# Altium schematic sheet PMOD_ARD_RASP.SchDoc
size A3
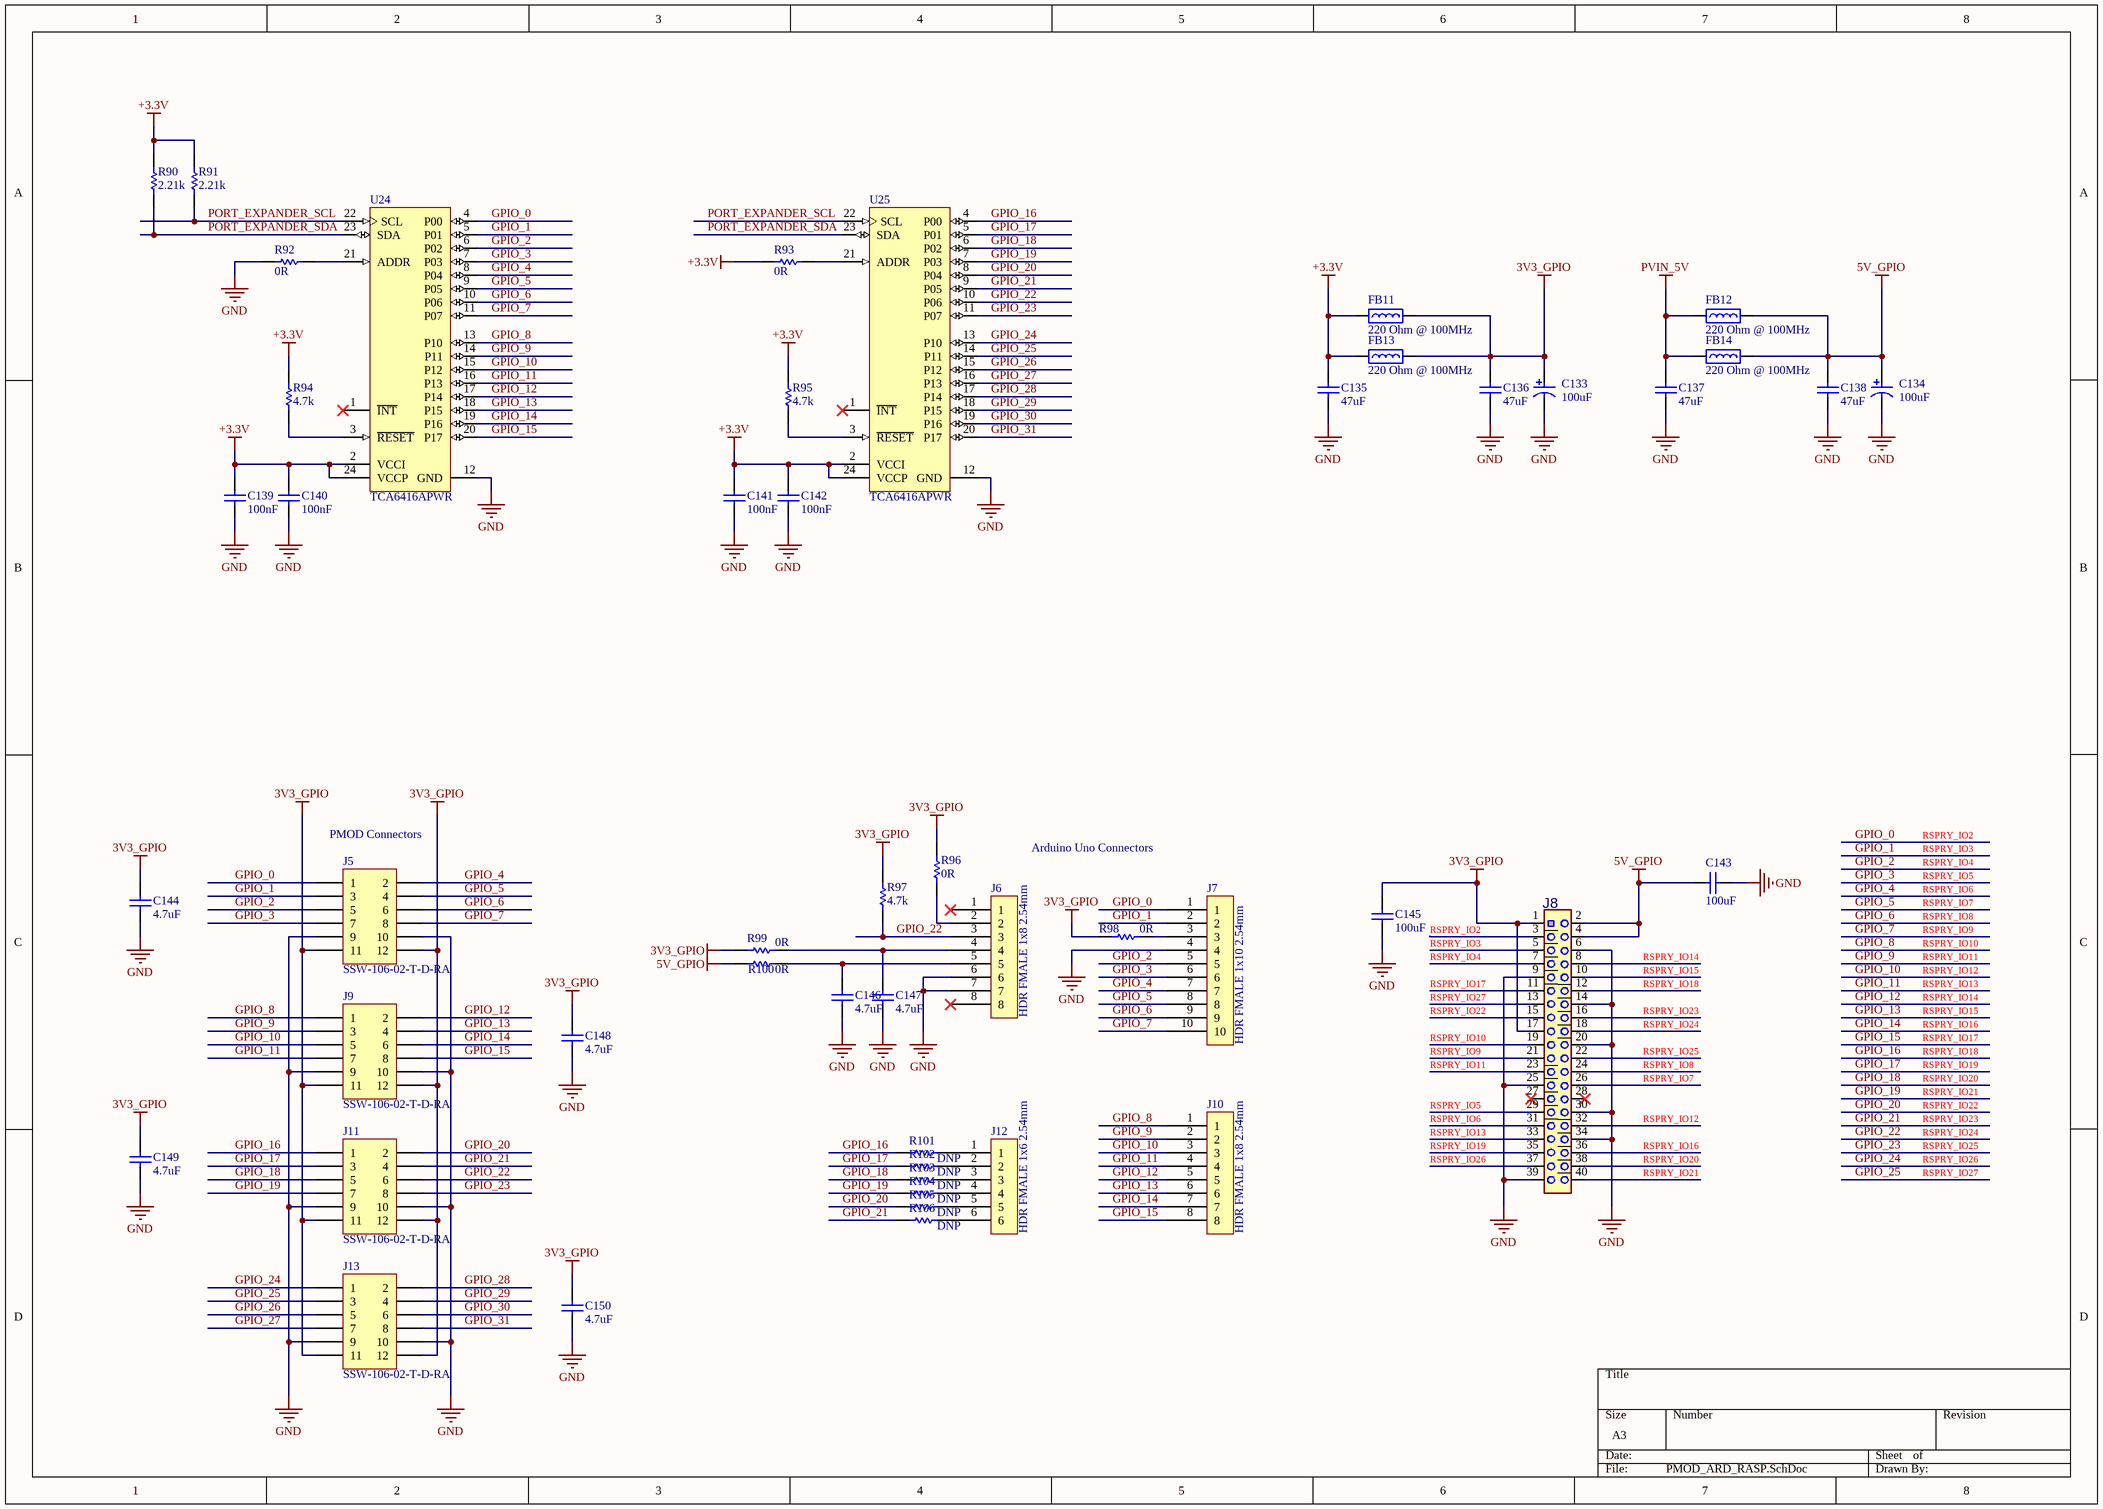
[diagram p0: PMOD_ARD_RASP.SchDoc]

## Parts
C133  100uF  [AVX_TAN_F95_P_0905]
C134  100uF  [AVX_TAN_F95_P_0905]
C135  47uF  [CAPC3216L_1206]
C136  47uF  [CAPC3216L_1206]
C137  47uF  [CAPC3216L_1206]
C138  47uF  [CAPC3216L_1206]
C139  100nF  [CAPC1005L_0402]
C140  100nF  [CAPC1005L_0402]
C141  100nF  [CAPC1005L_0402]
C142  100nF  [CAPC1005L_0402]
C143  100uF  [CAPC3225N_1210]
C144  4.7uF  [CAPC1005L_0402]
C145  100uF  [CAPC3225N_1210]
C146  4.7uF  [CAPC1005L_0402]
C147  4.7uF  [CAPC1005L_0402]
C148  4.7uF  [CAPC1005L_0402]
C149  4.7uF  [CAPC1005L_0402]
C150  4.7uF  [CAPC1005L_0402]
FB11  Impedance @ Frequency: 220 Ohm @ 100MHz  [INDC1608N_0603]  (hidden comment: BEAD0603_220_2A5_40M)
FB12  Impedance @ Frequency: 220 Ohm @ 100MHz  [INDC1608N_0603]  (hidden comment: BEAD0603_220_2A5_40M)
FB13  Impedance @ Frequency: 220 Ohm @ 100MHz  [INDC1608N_0603]  (hidden comment: BEAD0603_220_2A5_40M)
FB14  Impedance @ Frequency: 220 Ohm @ 100MHz  [INDC1608N_0603]  (hidden comment: BEAD0603_220_2A5_40M)
J5  SSW-106-02-T-D-RA  [HDR2X6H]
J6  HDR FMALE 1x8 2.54mm  [Hdr_Female_1x8_2.54mm]
J7  HDR FMALE 1x10 2.54mm  [Hdr_Female_1x10_2.54mm]
J8  Header 2x20  [HDR_M_2.54_2x20]  (value not drawn)
J9  SSW-106-02-T-D-RA  [HDR2X6H]
J10  HDR FMALE 1x8 2.54mm  [Hdr_Female_1x8_2.54mm]
J11  SSW-106-02-T-D-RA  [HDR2X6H]
J12  HDR FMALE 1x6 2.54mm  [Hdr_Female_1x6_2.54mm]
J13  SSW-106-02-T-D-RA  [HDR2X6H]
R90  value 2.21k  [RESC1005L_0402]  (hidden comment: RES0402_2K21_0W1_1T)
R91  value 2.21k  [RESC1005L_0402]  (hidden comment: RES0402_2K21_0W1_1T)
R92  value 0R  [RESC1005L_0402]  (hidden comment: RES0402_0R_0W1)
R93  value 0R  [RESC1005L_0402]  (hidden comment: RES0402_0R_0W1)
R94  value 4.7k  [RESC1005L_0402]  (hidden comment: RES0402_4K7_0W1_1T)
R95  value 4.7k  [RESC1005L_0402]  (hidden comment: RES0402_4K7_0W1_1T)
R96  value 0R  [RESC1005L_0402]  (hidden comment: RES0402_0R)
R97  value 4.7k  [RESC1005L_0402]  (hidden comment: RES0402_4K7_0W1_1T)
R98  value 0R  [RESC1005L_0402]  (hidden comment: RES0402_0R)
R99  value 0R  [RESC1005L_0402]  (hidden comment: RES0402_0R)
R100  value 0R  [RESC1005L_0402]  (hidden comment: RES0402_0R)
R101  value DNP  [RESC1005L_0402]  (hidden comment: RES0402)
R102  value DNP  [RESC1005L_0402]  (hidden comment: RES0402)
R103  value DNP  [RESC1005L_0402]  (hidden comment: RES0402)
R104  value DNP  [RESC1005L_0402]  (hidden comment: RES0402)
R105  value DNP  [RESC1005L_0402]  (hidden comment: RES0402)
R106  value DNP  [RESC1005L_0402]  (hidden comment: RES0402)
U24  TCA6416APWR  [PW24_L]
U25  TCA6416APWR  [PW24_L]

## Nets
3V3_GPIO: C133.1 C136.2 C144.2 C145.2 C148.2 C149.2 C150.2 FB11.2 FB13.2 J5.11 J5.12 J8.1(P1) J8.17(P17) J9.11 J9.12 J11.11 J11.12 J13.11 J13.12 R96.1 R97.2 R98.2 R99.2
5V_GPIO: C134.1 C138.2 C143.2 FB12.2 FB14.2 J8.2(P2) J8.4(P4) R100.2
+3.3V: C135.2 C139.2 C140.2 C141.2 C142.2 FB11.1 FB13.1 R90.2 R91.2 R93.1 R94.2 R95.2 U24.2(VCCI) U24.24(VCCP) U25.2(VCCI) U25.24(VCCP)
GND: C133.2 C134.2 C135.1 C136.1 C137.1 C138.1 C139.1 C140.1 C141.1 C142.1 C143.1 C144.1 C145.1 C146.1 C147.1 C148.1 C149.1 C150.1 J5.9 J5.10 J6.6 J6.7 J7.4 J8.6(P6) J8.9(P9) J8.14(P14) J8.20(P20) J8.25(P25) J8.30(P30) J8.34(P34) J8.39(P39) J9.9 J9.10 J11.9 J11.10 J13.9 J13.10 R92.1 U24.12(GND) U25.12(GND)
PVIN_5V: C137.2 FB12.1 FB14.1
GPIO_0: J5.1 J7.1 J8.3(P3) U24.4(P00)  [also labelled RSPRY_IO2]
GPIO_1: J5.3 J7.2 J8.5(P5) U24.5(P01)  [also labelled RSPRY_IO3]
GPIO_2: J5.5 J7.5 J8.7(P7) U24.6(P02)  [also labelled RSPRY_IO4]
GPIO_3: J5.7 J7.6 J8.29(P29) U24.7(P03)  [also labelled RSPRY_IO5]
GPIO_4: J5.2 J7.7 J8.31(P31) U24.8(P04)  [also labelled RSPRY_IO6]
GPIO_5: J5.4 J7.8 J8.26(P26) U24.9(P05)  [also labelled RSPRY_IO7]
GPIO_6: J5.6 J7.9 J8.24(P24) U24.10(P06)  [also labelled RSPRY_IO8]
GPIO_7: J5.8 J7.10 J8.21(P21) U24.11(P07)  [also labelled RSPRY_IO9]
GPIO_8: J8.19(P19) J9.1 J10.1 U24.13(P10)  [also labelled RSPRY_IO10]
GPIO_9: J8.23(P23) J9.3 J10.2 U24.14(P11)  [also labelled RSPRY_IO11]
GPIO_10: J8.32(P32) J9.5 J10.3 U24.15(P12)  [also labelled RSPRY_IO12]
GPIO_11: J8.33(P33) J9.7 J10.4 U24.16(P13)  [also labelled RSPRY_IO13]
GPIO_12: J8.8(P8) J9.2 J10.5 U24.17(P14)  [also labelled RSPRY_IO14]
GPIO_13: J8.10(P10) J9.4 J10.6 U24.18(P15)  [also labelled RSPRY_IO15]
GPIO_14: J8.36(P36) J9.6 J10.7 U24.19(P16)  [also labelled RSPRY_IO16]
GPIO_15: J8.11(P11) J9.8 J10.8 U24.20(P17)  [also labelled RSPRY_IO17]
GPIO_16: J8.12(P12) J11.1 R101.1 U25.4(P00)  [also labelled RSPRY_IO18]
GPIO_17: J8.35(P35) J11.3 R102.1 U25.5(P01)  [also labelled RSPRY_IO19]
GPIO_18: J8.38(P38) J11.5 R103.1 U25.6(P02)  [also labelled RSPRY_IO20]
GPIO_19: J8.40(P40) J11.7 R104.1 U25.7(P03)  [also labelled RSPRY_IO21]
GPIO_20: J8.15(P15) J11.2 R105.1 U25.8(P04)  [also labelled RSPRY_IO22]
GPIO_21: J8.16(P16) J11.4 R106.1 U25.9(P05)  [also labelled RSPRY_IO23]
GPIO_22: J6.3 J8.18(P18) J11.6 R97.1 U25.10(P06)  [also labelled RSPRY_IO24]
GPIO_23: J8.22(P22) J11.8 U25.11(P07)  [also labelled RSPRY_IO25]
GPIO_24: J8.37(P37) J13.1 U25.13(P10)  [also labelled RSPRY_IO26]
GPIO_25: J8.13(P13) J13.3 U25.14(P11)  [also labelled RSPRY_IO27]
GPIO_26: J13.5 U25.15(P12)
GPIO_27: J13.7 U25.16(P13)
GPIO_28: J13.2 U25.17(P14)
GPIO_29: J13.4 U25.18(P15)
GPIO_30: J13.6 U25.19(P16)
GPIO_31: J13.8 U25.20(P17)
PORT_EXPANDER_SCL: R91.1 U24.22(SCL) U25.22(SCL)
PORT_EXPANDER_SDA: R90.1 U24.23(SDA) U25.23(SDA)
NetC146_2: C146.2 J6.5 R100.1
NetC147_2: C147.2 J6.4 R99.1
NetJ6_2: J6.2 R96.2
NetJ7_3: J7.3 R98.1
NetJ12_1: J12.1 R101.2
NetJ12_2: J12.2 R102.2
NetJ12_3: J12.3 R103.2
NetJ12_4: J12.4 R104.2
NetJ12_5: J12.5 R105.2
NetJ12_6: J12.6 R106.2
NetR92_2: R92.2 U24.21(ADDR)
NetR93_2: R93.2 U25.21(ADDR)
NetR94_1: R94.1 U24.3(~{RESET})
NetR95_1: R95.1 U25.3(~{RESET})

Not connected (* = marked no-connect by the designer): J6 1* 8*; J8 27(P27)* 28(P28)*; U24 1(~{INT})*; U25 1(~{INT})*

## Notes on the sheet
- (near J5) PMOD Connectors
- Arduino Uno Connectors

## Library data of the parts
C133 C134 = CAPELE0905TAN100U6V3_20T: CAP TANT 100UF 6.3V 20% 0805; Manufacturer 1: AVX Corporation; Manufacturer Part Number 1: F950J107MPAAQ2; Temperature Coefficient: Tantalum; ESR: 1.2 Ohm; Package: 0905 P; ComponentLink1Description: Datasheet; ComponentLink1URL: C:\Users\Public\Documents\Altium\AD16\Library\PDF\F95.pdf; Value: 100uF; Voltage: 6.3V; Tolerance: 20%; Supplier 1: Digi-Key; Supplier Part Number 1: 478-8393-1-ND; Operating Temperature: -55°C ~ 125°C
C135-C138 = CAPCER1206X5R47U25V_20T: CAP CER 47UF 25V X5R 1206; Manufacturer 1: TDK Corporation; Manufacturer Part Number 1: C3216X5R1E476M160AC; Tolerance: 20%; Package: 1206; ComponentLink1Description: Datasheet; Value: 47uF; Voltage: 25V; Temperature Coefficient: X5R; Supplier 1: Digi-Key; Supplier Part Number 1: 445-8047-1-ND; Operating Temperature: -55°C ~ 85°C
C139-C142 = CAPCER0402X7R100N25V_10T: CAP CER 0.1UF 25V X7R 0402; Manufacturer 1: Murata Electronics North America; Manufacturer Part Number 1: GRM155R71E104KE14D; Tolerance: 10%; Package: 0402; ComponentLink1Description: Datasheet; Value: 100nF; Voltage: 25V; Temperature Coefficient: X7R; Supplier 1: Digi-Key; Supplier Part Number 1: 490-10698-1-ND; Operating Temperature: -55°C ~ 125°C
C143 C145 = CAPCER1210X5R100U16V_20T: CAP CER 100UF 16V X5R 1210; Manufacturer 1: Taiyo Yuden; Manufacturer Part Number 1: EMK325ABJ107MM-T; Tolerance: 20%; Package: 1210; ComponentLink1Description: Datasheet; Value: 100uF; Voltage: 16V; Temperature Coefficient: X5R; Supplier 1: Digi-Key; Supplier Part Number 1: 587-3152-1-ND; Operating Temperature: -55°C ~ 85°C
C144 C146-C150 = CAPCER0402X5R4U710V_10T: CAP CER 4.7UF 10V X5R 0402; Manufacturer 1: TDK Corporation; Manufacturer Part Number 1: C1005X5R1A475K050BC; Tolerance: 10%; Package: 0402; ComponentLink1Description: Datasheet; Value: 4.7uF; Voltage: 10V; Temperature Coefficient: x5R; Supplier 1: Digi-Key; Supplier Part Number 1: 445-13820-1-ND; Operating Temperature: -55°C ~ 85°C
FB11-FB14 = BEAD0603_220_2A5_40M: FERRITE BEAD 220 OHM 0603 1LN; Manufacturer 1: Murata Electronics North America; Manufacturer Part Number 1: BLM18SG221TN1D; Current Rating (Max): 2.5A; DC Resistance (DCR) (Max): 40 mohm; Package: 0603; ComponentLink1Description: Datasheet; ComponentLink1URL: C:\Users\Public\Documents\Altium\AD16\Library\PDF\ENFA0003.pdf; Supplier 1: Digi-Key; Supplier Part Number 1: 490-5225-1-ND; Operating Temperature: -55°C ~ 125°C
J5 J9 J11 J13 = SSW-106-02-T-D-RA: CONN RCPT .100" 12PS DL R/A TIN; Manufacturer 1: Samtec Inc.; ComponentLink1Description: Datasheet; ComponentLink1URL: C:\Users\Public\Documents\Altium\AD16\Library\PDF\ssw-1xx-xx-xxx-x-xx-xxx-xx-mkt.pdf; Supplier 1: Digi-Key; Supplier Part Number 1: SAM10026-ND; Manufacturer Part Number 1: SSW-106-02-T-D-RA; Operating Temperature: -55°C ~ 105°C; Insulation Height: 0.195" (4.95mm)
J6 J10 = M20-7820842: 08-WAY SIL VERT SOCKET L/FREE; Manufacturer 1: Harwin Inc; Connector Type: Receptacle; Number of Positions: 8; Number of Positions Loaded: All; Pitch: 0.100" (2.54mm); .Creator: MM; .Checked PCB: RF; Supplier 1: Digi-Key; Manufacturer Part Number 1: M20-7820842; RoHS: RoHS Compliant; Category: Connectors, Interconnects; Stock 1: 2070; Pricing 1: 1=1.1, 29=0.91207, 58=0.87397, 116=0.83603, 261=0.76, 522=0.684, 1015=0.608, 2523=0.551 (USD); Packaging: Tube; Contact Type: Female Socket; Number of Rows: 1; Row Spacing: -; Mounting Type: Through Hole; Termination: Solder; Fastening Type: -; Features: -; Contact Finish: Gold; Contact Finish Thickness: Flash; Color: Black; ComponentLink1URL: http://harwin.com/includes/pdfs/M20-782.pdf; ComponentLink1Description: http://harwin.com/includes/pdfs/M20-782.pdf; Supplier Part Number 1: 952-1823-ND; .Checked SCH: RF
J7 = M20-7821046: 10-WAY SIL VERT SOCKET L/FREE; Manufacturer 1: Harwin Inc; Connector Type: Receptacle; Number of Positions: 10; Number of Positions Loaded: All; Pitch: 0.100" (2.54mm); .Creator: MM; .Checked PCB: RF; Supplier 1: Digi-Key; Manufacturer Part Number 1: M20-7821046; RoHS: RoHS Compliant; Category: Connectors, Interconnects; Stock 1: 214; Pricing 1: 1=1.28, 23=1.12217, 46=1.05609, 69=1.01203, 115=0.968, 253=0.88, 506=0.792, 1012=0.704, 2507=0.638 (USD); Packaging: Tube; Contact Type: Female Socket; Number of Rows: 1; Row Spacing: -; Mounting Type: Through Hole; Termination: Solder; Fastening Type: -; Features: -; Contact Finish: Tin; Contact Finish Thickness: -; Color: Black; ComponentLink1URL: http://harwin.com/includes/pdfs/M20-782.pdf; ComponentLink1Description: http://harwin.com/includes/pdfs/M20-782.pdf; Supplier Part Number 1: 952-1847-ND; .Checked SCH: RF
J8 = Header 2x20: CONN HEADER 40POS .100" SGL GOLD
J12 = M20-7820646: 06-WAY SIL VERT SOCKET L/FREE; Manufacturer 1: Harwin Inc; Connector Type: Receptacle; Number of Positions: 6; Number of Positions Loaded: All; Pitch: 0.100" (2.54mm); .Checked PCB: MM; Supplier 1: Digi-Key; Manufacturer Part Number 1: M20-7820646; RoHS: RoHS Compliant; Category: Connectors, Interconnects; Stock 1: 87; Pricing 1: 1=0.96, 38=0.79211, 76=0.75895, 114=0.72596, 266=0.66, 532=0.594, 1026=0.528, 2508=0.4785 (USD); Packaging: Tube; Contact Type: Female Socket; Number of Rows: 1; Row Spacing: -; Mounting Type: Through Hole; Termination: Solder; Fastening Type: -; Features: -; Contact Finish: Tin; Contact Finish Thickness: -; Color: Black; ComponentLink1URL: http://harwin.com/includes/pdfs/M20-782.pdf; ComponentLink1Description: http://harwin.com/includes/pdfs/M20-782.pdf; Supplier Part Number 1: 952-1809-ND; .Checked SCH: MM; .Creator: MM
R90 R91 = RES0402_2K21_0W1_1T: RES SMD 2.21K OHM 1% 1/10W 0402; Manufacturer 1: Panasonic Electronic Components; Manufacturer Part Number 1: ERJ-2RKF2211X; Package: 0402; ComponentLink1Description: Datasheet; Power: 1/10W; Tolerance: 1%; Supplier 1: Digi-Key; Supplier Part Number 1: P2.21KLCT-ND
R92 R93 = RES0402_0R_0W1: RES SMD 0 OHM JUMPER 1/10W 0402; Manufacturer 1: Panasonic Electronic Components; Manufacturer Part Number 1: ERJ-2GE0R00X; Package: 0402; ComponentLink1Description: Datasheet; Power: 1/10W; Tolerance: -; Supplier 1: Digi-Key; Supplier Part Number 1: P0.0JCT-ND
R94 R95 R97 = RES0402_4K7_0W1_1T: RES SMD 4.7K OHM 1% 1/10W 0402; Manufacturer 1: Panasonic Electronic Components; Manufacturer Part Number 1: ERJ-2RKF4701X; Package: 0402; ComponentLink1Description: Datasheet; Power: 1/10W; Tolerance: 1%; Supplier 1: Digi-Key; Supplier Part Number 1: P4.70KLCT-ND
R96 R98-R100 = RES0402_0R: RES SMD 0 OHM JUMPER 1/16W 0402; Manufacturer 1: Vishay Dale; Manufacturer Part Number 1: CRCW04020000Z0ED; Power: 0.063W, 1/16W; Package: 0402; ComponentLink1Description: Datasheet; Tolerance: -; Supplier 1: Digi-Key; Supplier Part Number 1: 541-0.0JCT-ND
R101-R106 = RES0402: RES SMD 0402 Footprint; Package: 0402; ComponentLink1Description: Datasheet; Tolerance: -
U24 U25 = TCA6416APWR: Low-Voltage 16-Bit I2C and SMBus I/O Expander, 16 Outputs, 1.65 to 5.5 V, -40 to 85 degC, 24-pin TSSOP (PW), Green (RoHS & no Sb/Br); Manufacturer: Texas Instruments; SubFamily: I2C IO Expander; No. of Outputs: 16; Interrupt Output: Yes; fSCLK(Max)(MHz): 400; VCC(Min)(V): 1.65; VCC(Max)(V): 5.5; I2C Address: 0100 00x; DatasheetVersion: SCPS194A; PackageVersion: revG, Feb-2011; PackageReference: PW24; PackageDescription: 24-Pin Thin Small Outline Package 0.65 mm Pitch; Supplier 1: Arrow; Supplier Part Number 1: 47581856S8237284N7713; Supplier 2: Digi-Key; Supplier Part Number 2: 296-24536-2-ND; Supplier 3: Digi-Key; Supplier Part Number 3: 296-24536-1-ND; Supplier 4: Digi-Key; Supplier Part Number 4: 296-24536-6-ND; Supplier 5: Farnell; Supplier Part Number 5: 2101304; Supplier 6: Newark; Supplier Part Number 6: 10R6151; Supplier 7: Mouser; Supplier Part Number 7: 595-TCA6416APWR; Eco-Plan: Green (RoHS & no Sb/Br); Reset Input: Yes; Max Frequency(kHz): 400; # of I/Os: 16; Vcc range(V): 1.65 to 5.5; Low Power: Yes; Configuration Registers: Yes; 5V Tolerant I/O: Yes; Push-Pull I/O Type: Yes; Mounting Technology: Surface Mount; PartNumber: TCA6416APWR; Code_JEDEC: MO-153; ComponentLink1Description: Datasheet; ComponentLink1URL: http://www.ti.com/general/docs/lit/getliterature.tsp?genericPartNumber=TCA6416A&fileType=pdf; ComponentLink2Description: Package Specification; ComponentLink2URL: http://www.ti.com/litv/pdf/mpds177g